# EAGLE design LB_BIT_i13_LIGHTSENSOR-v03(5_5) (EAGLE 6.6.0)
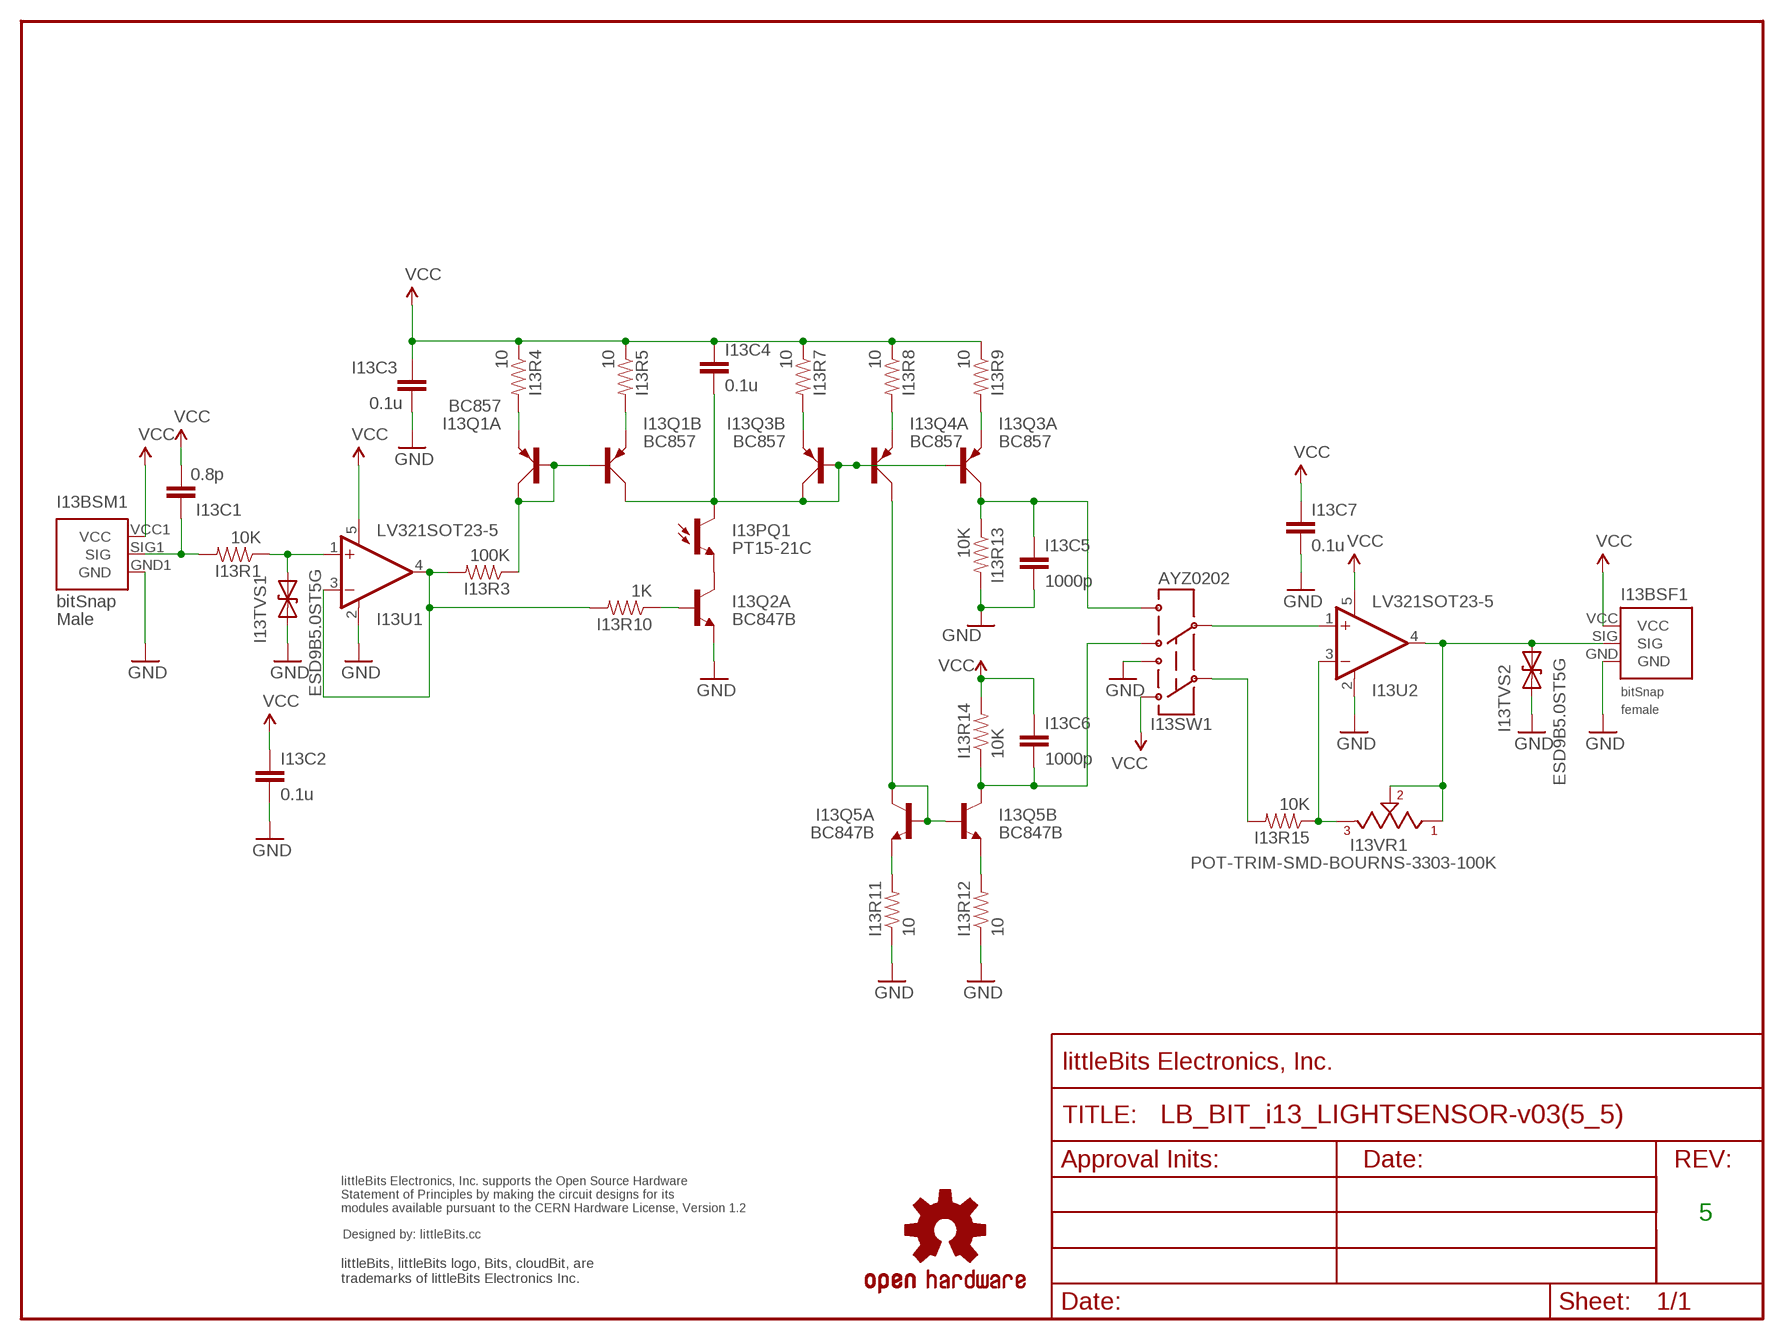
[diagram p0: schematic, sheet 1]

## Parts
I13BSF1  BITSNAP_V03_FEMALE  [BITSNAP_V03_FEMALE]
I13BSM1  BITSNAP_V03_MALE  [BITSNAP_V03_MALE]
I13C1  0.8p  CAPCAP-0603  [CAP-0603]
I13C2  0.1u  CAPCAP-0603  [CAP-0603]
I13C3  0.1u  CAPCAP-0603  [CAP-0603]
I13C4  0.1u  CAPCAP-0603  [CAP-0603]
I13C5  1000p  CAPCAP-0603  [CAP-0603]
I13C6  1000p  CAPCAP-0603  [CAP-0603]
I13C7  0.1u  CAPCAP-0603  [CAP-0603]
I13PQ1  PT15-21C  TRANS-PHOTO  [PHOTOTRANS-1206]
I13Q1  BC857  TRANS-BJT_PNP-DUALBC857  [SOT-363_PHILLIPS]
I13Q2  BC847B  TRANS-BJT_NPN-DUAL-BC847BS  [SOT-363_PHILLIPS]
I13Q3  BC857  TRANS-BJT_PNP-DUALBC857  [SOT-363_PHILLIPS]
I13Q4  BC857  TRANS-BJT_PNP-DUALBC857  [SOT-363_PHILLIPS]
I13Q5  BC847B  TRANS-BJT_NPN-DUAL-BC847BS  [SOT-363_PHILLIPS]
I13R1  10K  RESISTOR0603  [RES-0603]
I13R3  100K  RESISTOR0603  [RES-0603]
I13R4  10  RESISTOR0603  [RES-0603]
I13R5  10  RESISTOR0603  [RES-0603]
I13R7  10  RESISTOR0603  [RES-0603]
I13R8  10  RESISTOR0603  [RES-0603]
I13R9  10  RESISTOR0603  [RES-0603]
I13R10  1K  RESISTOR0603  [RES-0603]
I13R11  10  RESISTOR0603  [RES-0603]
I13R12  10  RESISTOR0603  [RES-0603]
I13R13  10K  RESISTOR0603  [RES-0603]
I13R14  10K  RESISTOR0603  [RES-0603]
I13R15  10K  RES-0603  [RES-0603]
I13SW1  AYZ0202  [AYZ0202]
I13TVS1  ESD9B5.0ST5G  DIODE-TVSSOD-923  [SOD-923]
I13TVS2  ESD9B5.0ST5G  DIODE-TVSSOD-923  [SOD-923]
I13U1  LV321SOT23-5  [SOT23-5]
I13U2  LV321SOT23-5  [SOT23-5]
I13VR1  POT-TRIM-SMD-BOURNS-3303-100K  POT-TRIM-SMD-BOURNS-3303  [POT-TRIM-SMD-BOURNS-3303]
U$1  OSHWCREDIT  [OSHWCREDIT]
U$2  OSHW-LOGOL  [OSHW-LOGO-L]
U$3  FRAME-LETTER-OHWOHW  [FABDWG01-OHW]

## Nets
GND: I13BSF1.GND I13BSM1.GND1(GND) I13C2.2 I13C3.2 I13C5.2 I13C7.2 I13Q2.1(A:E) I13R11.1 I13R12.1 I13R13.2 I13SW1.3 I13TVS1.1(A) I13TVS2.1(A) I13U1.2(V-) I13U2.2(V-)
N$1: I13C6.2 I13Q5.3(B:C) I13R14.1 I13SW1.4
N$2: I13Q5.1(A:E) I13R11.2
N$3: I13Q4.6(A:C) I13Q5.2(A:B) I13Q5.5(B:B) I13Q5.6(A:C)
N$4: I13Q5.4(B:E) I13R12.2
N$5: I13BSM1.SIG1(SIG) I13C1.1 I13R1.2
N$6: I13R15.1 I13U2.3(-IN) I13VR1.3
N$7: I13BSF1.SIG I13TVS2.2(C) I13U2.4(OUT) I13VR1.1 I13VR1.2
N$8: I13R3.2 I13R10.2 I13U1.3(-IN) I13U1.4(OUT)
N$9: I13Q1.2(A:B) I13Q1.5(B:B) I13Q1.6(A:C) I13R3.1
N$10: I13Q1.1(A:E) I13R4.2
N$11: I13Q1.4(B:E) I13R5.2
N$12: I13Q3.4(B:E) I13R7.2
N$13: I13C4.2 I13PQ1.C I13Q1.3(B:C) I13Q3.2(A:B) I13Q3.3(B:C) I13Q3.5(B:B) I13Q4.2(A:B)
N$14: I13Q4.1(A:E) I13R8.2
N$15: I13Q3.1(A:E) I13R9.2
N$16: I13SW1.5 I13U2.1(+IN)
N$17: I13R15.2 I13SW1.2
N$18: I13PQ1.E I13Q2.6(A:C)
N$19: I13C5.1 I13Q3.6(A:C) I13R13.1 I13SW1.6
N$20: I13Q2.2(A:B) I13R10.1
N$21: I13R1.1 I13TVS1.2(C) I13U1.1(+IN)
VCC: I13BSF1.VCC I13BSM1.VCC1(VCC) I13C1.2 I13C2.1 I13C3.1 I13C4.1 I13C6.1 I13C7.1 I13R4.1 I13R5.1 I13R7.1 I13R8.1 I13R9.1 I13R14.2 I13SW1.1 I13U1.5(V+) I13U2.5(V+)
Unconnected: I13Q2.3(B:C) I13Q2.4(B:E) I13Q2.5(B:B) I13Q4.3(B:C) I13Q4.4(B:E) I13Q4.5(B:B)

## Notes on the sheet
- 5

## Library data of the parts
I13BSF1 = bitSnap:BITSNAP_V03_FEMALE
I13BSM1 = bitSnap:BITSNAP_V03_MALE
I13C1-I13C7 = LITTLEBITS:CAP
I13PQ1 = LITTLEBITS:TRANS-PHOTO
I13Q1 I13Q3 I13Q4 = LITTLEBITS:TRANS-BJT_PNP-DUAL
I13Q2 I13Q5 = LITTLEBITS:TRANS-BJT_NPN-DUAL
I13R1 I13R3-I13R5 I13R7-I13R14 = LITTLEBITS:RESISTOR
I13R15 = LITTLEBITS:RES-0603: Resistor
I13SW1 = LITTLEBITS:AYZ0202
I13TVS1 I13TVS2 = LITTLEBITS:DIODE-TVS: Bidirectional Transient Voltage Suppression Diode: Device conducts in avalanche mode after reaching a part dependent voltage threshold. Used for limiting voltage spikes on ESD sensitive inputs and outputs.; IEC_ESD_PROT0: +/-18kV; LB_PN: ?; MPN: ESD9B5.0ST5G; V_CLAMP: ?; V_OPERATION: 5V
I13U1 I13U2 = LITTLEBITS:LV321
I13VR1 = LITTLEBITS:POT-TRIM-SMD-BOURNS-3303
U$1 = LITTLEBITS:OSHWCREDIT
U$2 = LITTLEBITS:OSHW-LOGO: Open Source Hardware Logo This logo indicates the piece of hardware it is found on incorporates a OSHW license and/or adheres to the definition of open source hardware found here: http://freedomdefined.org/OSHW
U$3 = LITTLEBITS:FRAME-LETTER-OHW

## Board
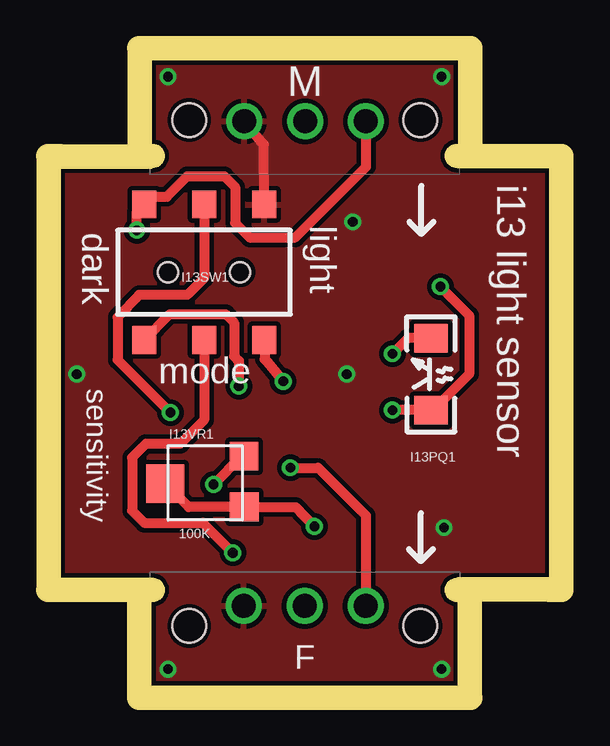
[diagram p1: board, top side]
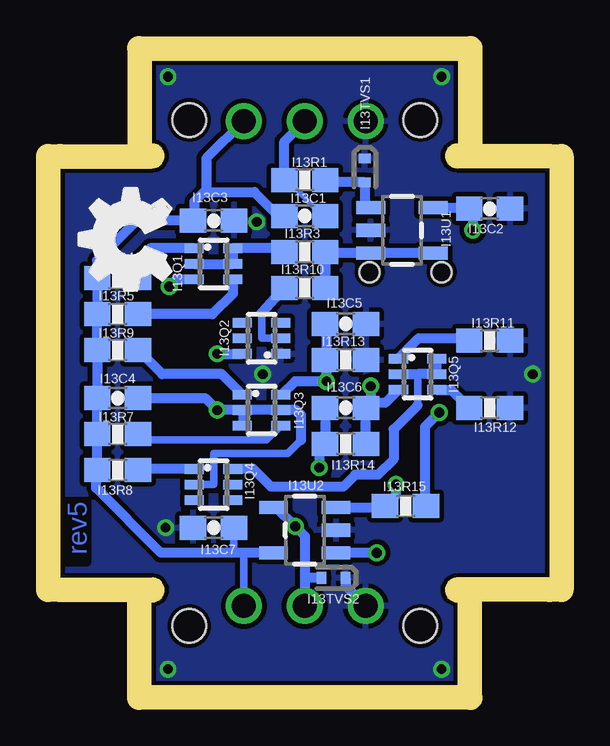
[diagram p2: board, bottom side, seen from below]

Size 20.4 x 26.1 mm. Coordinates in mm from the lower left corner, seen from the top.
Outline: 0,21.6 0,4.5
Outline: 20.4,4.5 20.4,21.6
Copper layers (1*16): Top 0.035mm / dielectric 1.5mm / Bottom 0.035mm
Design rules "default": minimum track width 0.2mm, minimum drill 0.4mm, track to track 0.2mm, track to pad 0.2mm, pad to pad 0.2mm, via to via 0.2mm, smd to smd 0mil, copper to edge 0.2mm, drill to drill 0.2mm, minimum pad ring 0.2mm, minimum via ring 0.15mm, stop-mask expansion 0.1mm, vias tented up to drill 0mil, thermal gap 0.2mm
Milling: 6 lines

### Footprints (pad centres in the part's own frame; a part is rotated, then mirrored left to right if it is on the bottom)
BITSNAP_V03_FEMALE = drill 1: GND 3.91,3.33; SIG 6.45,3.33; VCC 8.99,3.33 | hole 1.4: 1.63,2.5; 11.27,2.5
BITSNAP_V03_MALE = drill 1: GND1 8.98,2.56; SIG1 6.44,2.56; VCC1 3.9,2.56 | hole 1.4: 11.27,2.5; 1.63,2.5
CAP-0603 = smd 1.1 x 1: 1 -0.85,0; 2 0.85,0
PHOTOTRANS-1206 = smd 1.2 x 1.4: C -1.5,0; E 1.5,0
SOT-363_PHILLIPS = smd 0.4 x 0.8: 1 -0.65,-0.8; 2 0,-0.8; 3 0.65,-0.8; 4 0.65,0.8; 5 0,0.8; 6 -0.65,0.8
RES-0603 = smd 1.1 x 1: 1 -0.85,0; 2 0.85,0
AYZ0202 = smd 1 x 1.15: 1 -2.5,2.825; 2 0,2.825; 3 2.5,2.825; 4 -2.5,-2.825; 5 0,-2.825; 6 2.5,-2.825 | hole 0.85: 1.5,0; -1.5,0
SOD-923 = smd 0.4 x 0.5: 1 -0.5,0; 2 0.5,0
SOT23-5 = smd 0.55 x 1.2: 1 -0.95,-1.3; 2 0,-1.3; 3 0.95,-1.3; 4 0.95,1.3; 5 -0.95,1.3
POT-TRIM-SMD-BOURNS-3303 = smd 1.2 x 1.2: 1 0.543,-3.172; 3 2.66,-3.168 | smd 1.6 x 1.6: 2 1.52,0.115

### Placement (x,y rotation side)
I13BSF1  3.75,0 0 top
I13BSM1  16.65,26.1 180 top
I13C1  10.2,19.6 180 bottom
I13C2  2.5,19.9 0 bottom
I13C3  14,19.4 0 bottom
I13C4  18,12 0 bottom
I13C5  8.5,15.1 0 bottom
I13C6  8.5,11.6 0 bottom
I13C7  14,6.6 180 bottom
I13PQ1  15.45,13 90 top
I13Q1  14,17.6 270 bottom
I13Q2  12,14.5 90 bottom
I13Q3  12,11.5 270 bottom
I13Q4  14,8.4 270 bottom
I13Q5  5.5,13 270 bottom
I13R1  10.2,21.1 180 bottom
I13R3  10.2,18.1 0 bottom
I13R4  18,17 0 bottom
I13R5  18,15.5 0 bottom
I13R7  18,10.5 0 bottom
I13R8  18,9 0 bottom
I13R9  18,14 0 bottom
I13R10  10.2,16.6 0 bottom
I13R11  2.5,14.4 180 bottom
I13R12  2.5,11.6 180 bottom
I13R13  8.5,13.6 0 bottom
I13R14  8.5,10.1 180 bottom
I13R15  6,7.5 0 bottom
I13SW1  6,17.25 0 top
I13TVS1  7.7,21.5 270 bottom
I13TVS2  9,4.5 180 bottom
I13U1  6.15,19 270 bottom
I13U2  10.2,6.5 90 bottom
I13VR1  4.5,6.92 90 top
U$1  -92.4,-65.2 0 top  (outside the outline)
U$2  -34,-69.2 0 top  (outside the outline)
U$3  0,0 0 top
U$6  [OSHW_FILLX150_NOTEXT]  15.78,15.66 0 top

### Tracks (layer width: path | path; a pad name or v marks a point on that pad's centre or on a via)
GND  (via drill 0.41)
  Top 0.406: I13SW1.3 8.49,22.57 I13BSM1.GND1
  Bottom 0.406: I13TVS2.1 8.5,4.17 I13BSF1.GND
  other vias: 12.2,19.35 16,6.6 11.95,13 15.9,25.4 4.5,25.4 4.5,0.7 15.9,0.7 0.7,13
  pour Bottom: 0,0 20.4,0 20.4,26.1 0,26.1
  pour Top: 0,0 20.4,0 20.4,26.1 0,26.1
N$1  (via drill 0.41)
  Top 0.406: I13SW1.4 4.58,15.5 6.9,15.5 7.25,15.15 7.25,13.75 7.45,13.55 v7.45,12.5
  Bottom 0.406: v7.45,12.5 7.45,11.8 7.59,11.77 | 7.59,11.77 7.7,11.75 | I13Q5.3 6.85,11.8 7.59,11.8 | I13R14.1 I13C6.2 7.65,11.8 7.59,11.8 | 7.59,11.8 7.59,11.77
N$2
  Bottom 0.406: I13Q5.1 5.45,14.5 3.4,14.5 3.4,14.25 I13R11.2
N$3
  Bottom 0.305: 5.5,13 5.5,11.7
  Bottom 0.406: I13Q5.2 5.5,13 I13Q5.5 I13Q5.6 | 5.5,11.7 6.5,10.7 6.5,9.45 7.15,8.8 8.1,8.8 8.6,8.3 11.6,8.3 12.35,9.05 I13Q4.6
N$4
  Bottom 0.406: I13Q5.4 4.1,12.35 I13R12.2
N$5
  Bottom 0.203: 9.45,19.6 10.85,21
  Bottom 0.406: I13C1.1 9.45,19.6 | 10.85,21 10.95,21.2 I13R1.2 11.05,22.7 I13BSM1.SIG1
N$6  (via drill 0.41)
  Top 0.406: v6.4,8.4 7.58,9.58 I13VR1.3
  Bottom 0.406: I13U2.3 6.85,7.45 I13R15.1 6.4,7.95 v6.4,8.4 | I13U2.3
N$7  (via drill 0.41)
  Top 0.406: v10.6,6.65 9.81,7.46 I13VR1.1 5.36,7.46 I13VR1.2
  Bottom 0.406: I13TVS2.2 10.2,4.5 I13BSF1.SIG 10.2,6.25 v10.6,6.65 11.4,7.45 I13U2.4 11.8,7.45
N$8
  Bottom 0.406: I13U1.4 I13U1.3 9.35,18.05 I13R10.2 I13R3.2
N$9
  Bottom 0.406: I13Q1.2 I13Q1.5 I13Q1.6 11.15,18.25 I13R3.1
N$10
  Bottom 0.406: I13Q1.1 16.65,18.25 17.1,17.8 17.1,17.2 I13R4.2
N$11
  Bottom 0.406: I13Q1.4 13.2,16.35 14.05,15.5 I13R5.2
N$12
  Bottom 0.305: I13Q3.4 11.8,10.25 16.95,10.25
  Bottom 0.406: 16.95,10.25 17.15,10.35 I13R7.2
N$13  (via drill 0.41)
  Top 0.406: v15.85,16.65 17.05,15.45 17.05,13 15.55,11.5 I13PQ1.C v13.85,11.5
  Bottom 0.305: I13Q3.2 I13Q3.3 | I13Q4.2 14,8.4 14,9.7 10.9,9.7 10.35,10.25
  Bottom 0.406: 10.35,10.25 10.35,11.3 10.55,11.5 I13Q3.5 I13Q3.2 v13.85,11.5 14.35,12 I13C4.2 | I13Q1.3 15.55,16.95 v15.85,16.65
N$14
  Bottom 0.406: I13Q4.1 17.35,9.05 I13R8.2
N$15
  Bottom 0.406: I13Q3.1 13.65,13 16.15,13 I13R9.2
N$16  (via drill 0.41)
  Top 0.406: I13SW1.5 6,11.1 5,10.1 3.58,10.1 3,9.53 3,7.3 3.5,6.8 5.95,6.8 v7.2,5.55
  Bottom 0.406: 7.15,5.55 v7.2,5.55 I13U2.1
N$17  (via drill 0.41)
  Top 0.406: I13SW1.2 6,17 5.3,16.3 3.3,16.3 2.4,15.38 2.4,13.6 v4.6,11.4
  Bottom 0.406: v4.6,11.4 5.2,10.8 5.2,7.8 I13R15.2
N$18  (via drill 0.41)
  Top 0.406: I13PQ1.E 14.5,14.5 v13.85,13.85
  Bottom 0.406: v13.85,13.85 I13Q2.6
N$19  (via drill 0.41)
  Top 0.406: I13SW1.6 8.55,14.5 8.53,14.5 8.53,13.62 v9.3,12.7
  Bottom 0.406: v9.3,12.7 10.6,12.7 11.15,12.15 I13Q3.6 | 9.3,15.35 9.3,15.1 | 9.3,15.1 v9.3,12.7 | I13C5.1 9.3,15.1 | I13R13.1 9.3,13.55 v9.3,12.7
N$20
  Bottom 0.305: 12,15.55 12,14.5 I13Q2.2
  Bottom 0.406: I13R10.1 12,15.55
N$21
  Bottom 0.406: I13R1.1 9.35,21 I13TVS1.2 7.7,20.2 I13U1.1
VCC  (via drill 0.41)
  Top 0.406: I13BSM1.VCC1 12.75,21.65 9.8,18.7 7.9,18.7 7.3,19.3 7.3,20.8 6.85,21.25 5.3,21.25 4.45,20.4 3.6,20.4 3.52,20.1 I13SW1.1 3.2,19.77 v3.2,19 | v9.6,9.1 10.75,9.1 12.74,7.11 I13BSF1.VCC
  Bottom 0.305: I13BSF1.VCC 12.74,5.49 12.8,5.55 | I13C7.1 13.15,5.55
  Bottom 0.406: I13C1.2 11.2,19.65 11.3,19.6 12.3,20.6 14.4,20.6 | I13U2.5 12.8,5.55 13.15,5.55 16.2,5.55 18.9,8.25 18.9,8.7 18.9,8.95 I13R8.1 I13R7.1 I13C4.1 I13R9.1 I13R5.1 I13R4.1 18.85,17.75 17.2,19.4 I13C3.1 14.8,19.45 14.8,20.2 14.4,20.6 | I13R14.2 9.6,10.1 v9.6,9.1 | I13R14.2 9.3,10 | I13C6.1 I13R14.2 | I13U1.5 3.62,19.95 arc-90 I13SW1.1 | I13SW1.1 3.2,20.07 v3.2,19 | I13C2.1 3.35,19.93 I13SW1.1 | I13BSM1.VCC1 14.3,22 14.3,20.7 14.4,20.6

### Text on the board
Bottom: rev5
tPlace: i13 light sensor | dark | light | mode | sensitivity
tNames: I13VR1 | 100K
Reference: MEDIUM
dxf: 5 | LIGHT SENSOR BIT